# EasyEDA schematic oLoRa-part-GPS.json
TITLE: oLoRa-part-GPS; REV: 1.0; Date: 2019-08-19; Sheet: 1/1; Drawn By: 김석현; Company: RMTEC
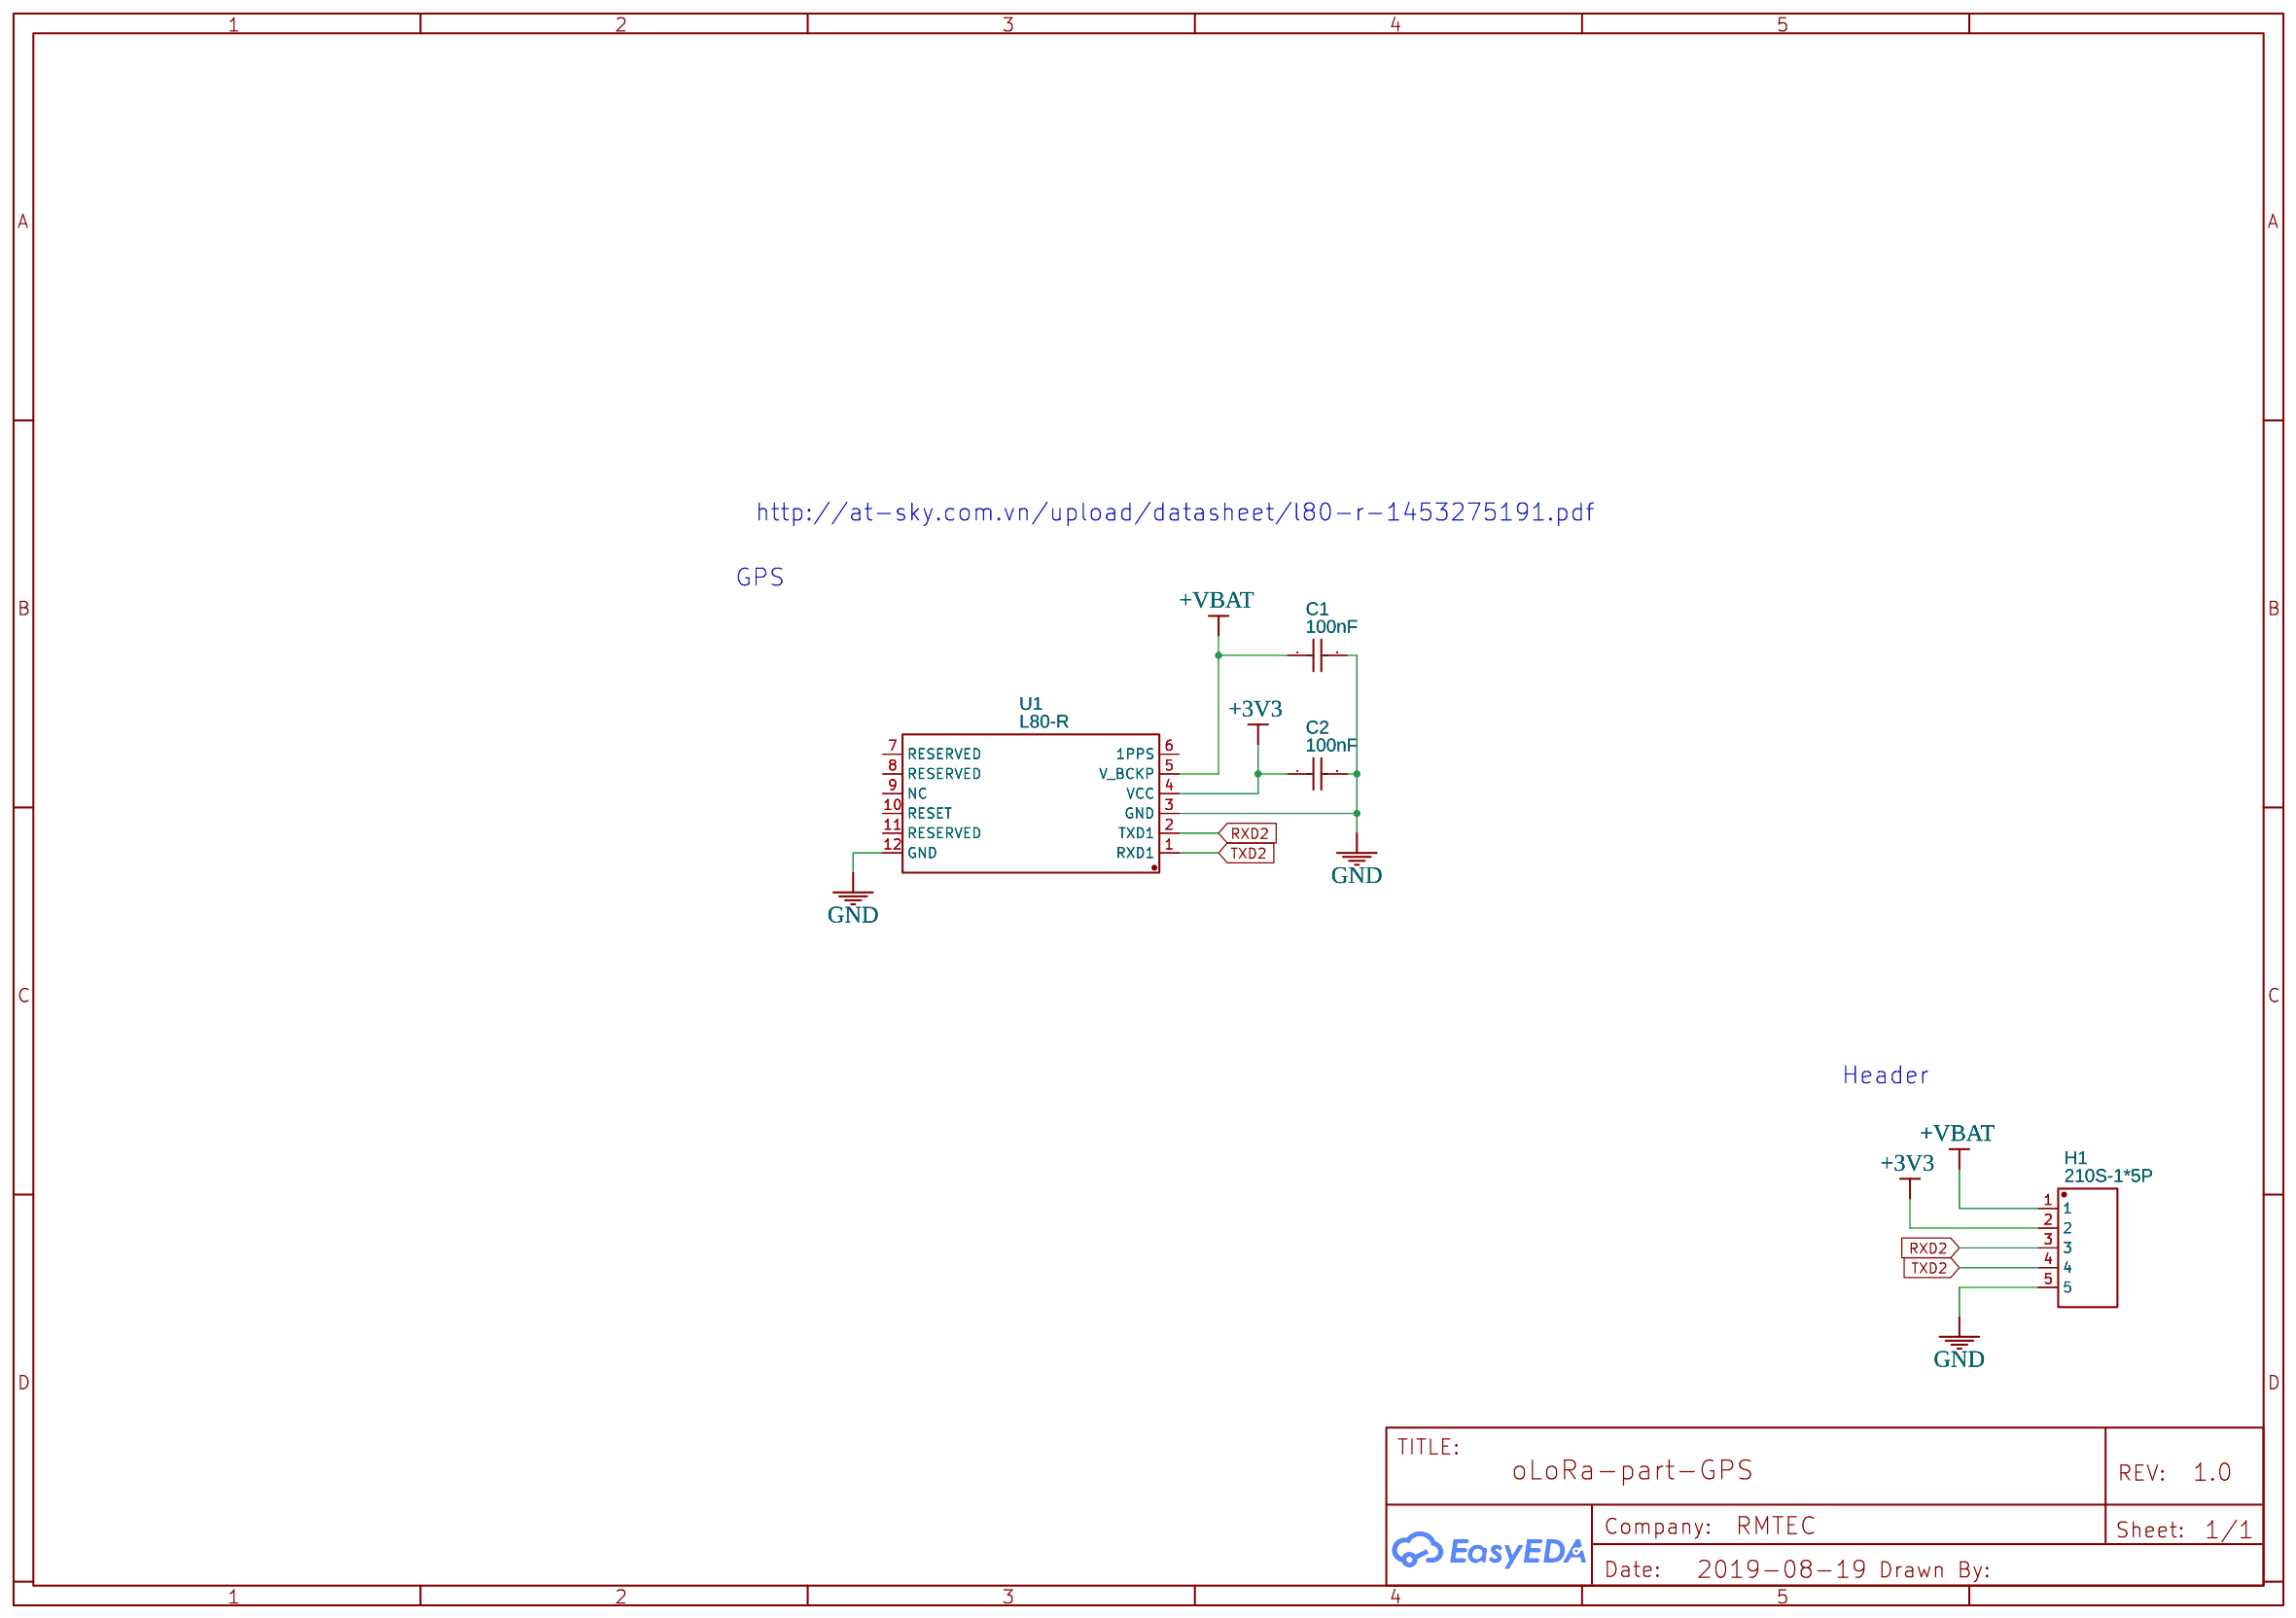
[diagram p0: schematic sheet]

## Parts
C1  100nF  [0603]
C2  100nF  [0603]
H1  210S-1*5P  [210S-1X5P]
U1  L80-R  [L80-R]

## Library data of the parts
C1 C2 = 0603B104K500NT: Supplier: LCSC; Manufacturer: FH; Supplier Part: C30926
H1 = -: Supplier: LCSC; Manufacturer: Ckmtw; Manufacturer Part: 210S-1*5P L=11.6MMGold-plated black; Contributor: LCSC; Supplier Part: C124379
U1 = -: Supplier: LCSC; Supplier Part: C188357; Manufacturer: Quectel; Contributor: LCSC

## Nets
+3V3: C2.2 H1.2 U1.4(VCC)
+VBAT: C1.2 H1.1 U1.5(V_BCKP)
GND: C1.1 C2.1 H1.5 U1.3(GND) U1.12(GND)
RXD2: H1.3 U1.2(TXD1)
TXD2: H1.4 U1.1(RXD1)

Not connected (* = marked no-connect by the designer): U1 6(1PPS) 7(RESERVED) 8(RESERVED) 9(NC) 10(RESET) 11(RESERVED)

## Notes on the sheet
- http://at-sky.com.vn/upload/datasheet/l80-r-1453275191.pdf
- GPS
- Header
